# Altium schematic sheet 继电器驱动输出.SchDoc
size A2
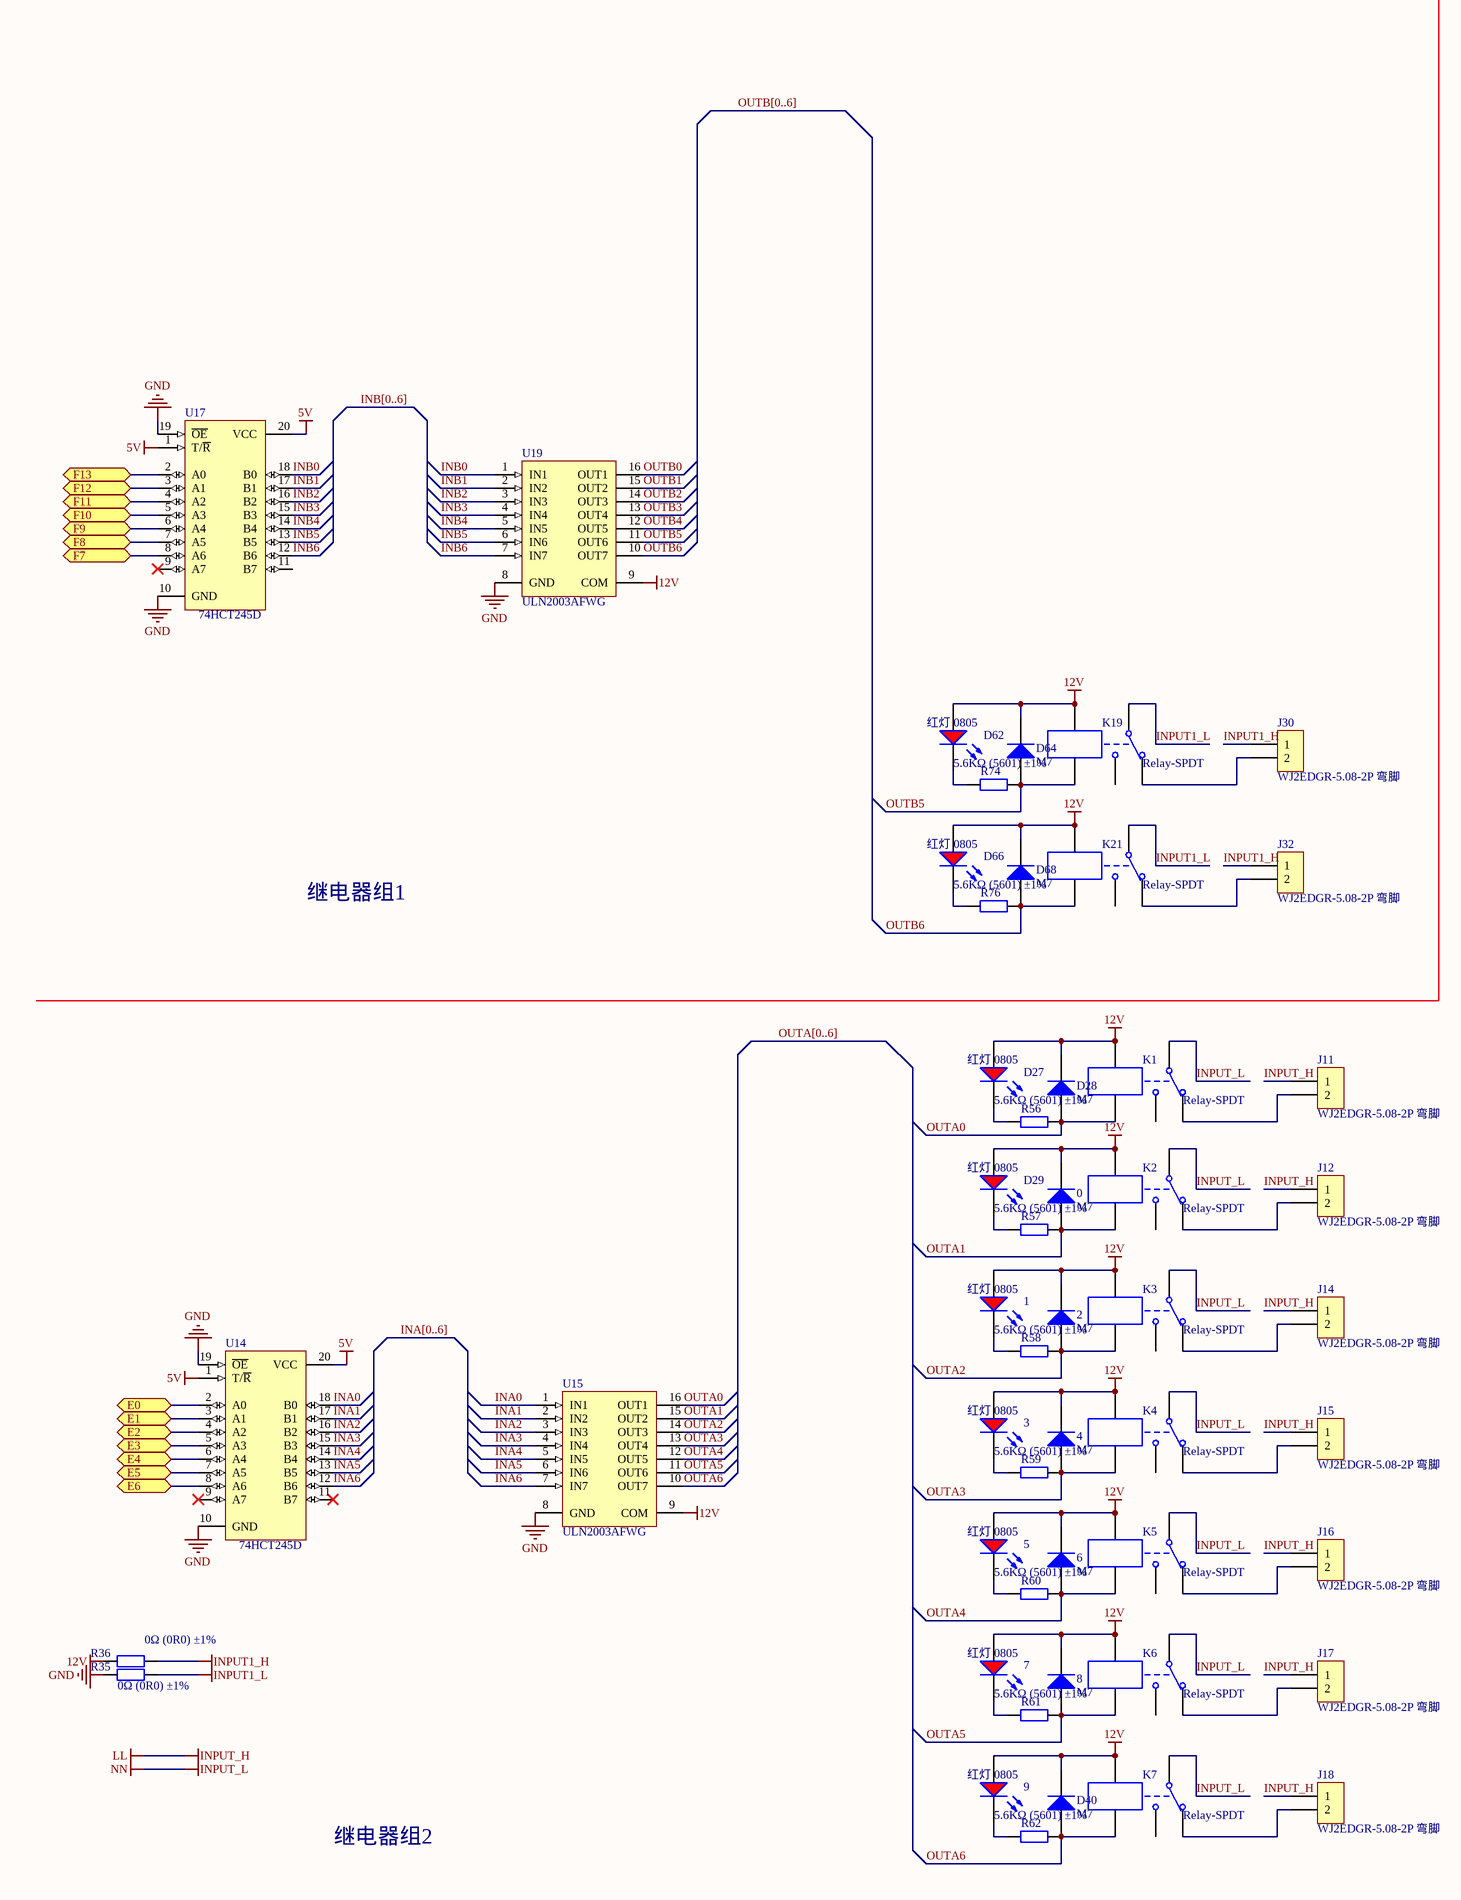
[diagram p0: 继电器驱动输出.SchDoc, left]
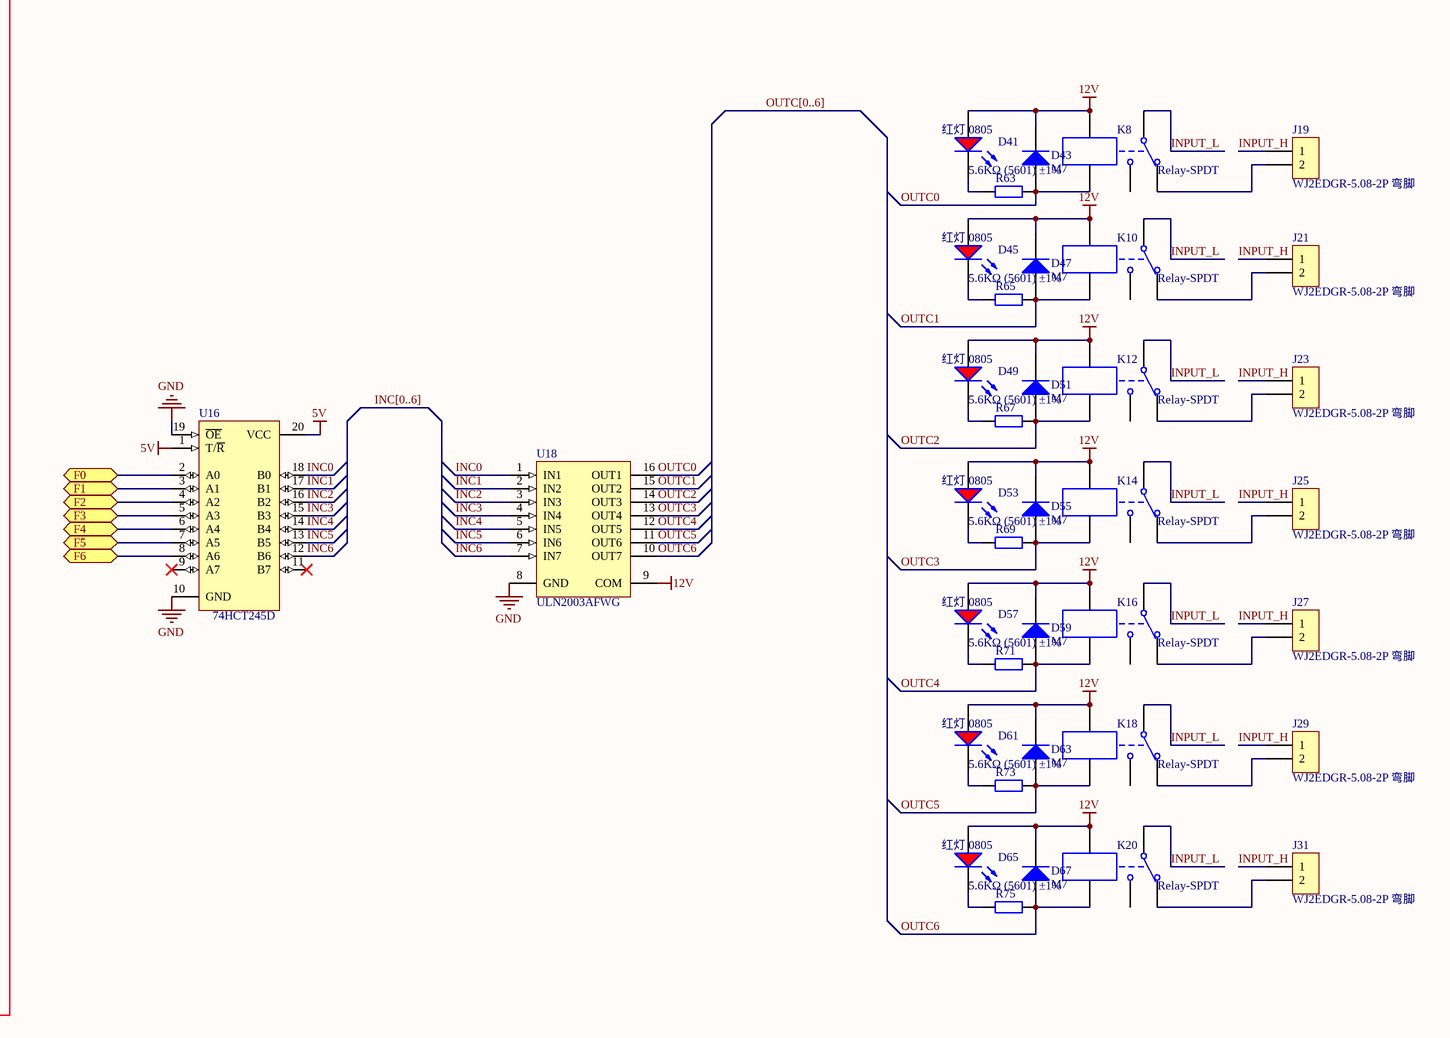
[diagram p1: 继电器驱动输出.SchDoc, right]

## Parts
0  M7  [SMA(DO-214AC)_S1]
1  红灯 0805  [0805_LED_S1]
2  M7  [SMA(DO-214AC)_S1]
3  红灯 0805  [0805_LED_S1]
4  M7  [SMA(DO-214AC)_S1]
5  红灯 0805  [0805_LED_S1]
6  M7  [SMA(DO-214AC)_S1]
7  红灯 0805  [0805_LED_S1]
8  M7  [SMA(DO-214AC)_S1]
9  红灯 0805  [0805_LED_S1]
D27  红灯 0805  [0805_LED_S1]
D28  M7  [SMA(DO-214AC)_S1]
D29  红灯 0805  [0805_LED_S1]
D40  M7  [SMA(DO-214AC)_S1]
D41  红灯 0805  [0805_LED_S1]
D43  M7  [SMA(DO-214AC)_S1]
D45  红灯 0805  [0805_LED_S1]
D47  M7  [SMA(DO-214AC)_S1]
D49  红灯 0805  [0805_LED_S1]
D51  M7  [SMA(DO-214AC)_S1]
D53  红灯 0805  [0805_LED_S1]
D55  M7  [SMA(DO-214AC)_S1]
D57  红灯 0805  [0805_LED_S1]
D59  M7  [SMA(DO-214AC)_S1]
D61  红灯 0805  [0805_LED_S1]
D62  红灯 0805  [0805_LED_S1]
D63  M7  [SMA(DO-214AC)_S1]
D64  M7  [SMA(DO-214AC)_S1]
D65  红灯 0805  [0805_LED_S1]
D66  红灯 0805  [0805_LED_S1]
D67  M7  [SMA(DO-214AC)_S1]
D68  M7  [SMA(DO-214AC)_S1]
J11  WJ2EDGR-5.08-2P 弯脚  [WJ2EDGR-5.08-2]
J12  WJ2EDGR-5.08-2P 弯脚  [WJ2EDGR-5.08-2]
J14  WJ2EDGR-5.08-2P 弯脚  [WJ2EDGR-5.08-2]
J15  WJ2EDGR-5.08-2P 弯脚  [WJ2EDGR-5.08-2]
J16  WJ2EDGR-5.08-2P 弯脚  [WJ2EDGR-5.08-2]
J17  WJ2EDGR-5.08-2P 弯脚  [WJ2EDGR-5.08-2]
J18  WJ2EDGR-5.08-2P 弯脚  [WJ2EDGR-5.08-2]
J19  WJ2EDGR-5.08-2P 弯脚  [WJ2EDGR-5.08-2]
J21  WJ2EDGR-5.08-2P 弯脚  [WJ2EDGR-5.08-2]
J23  WJ2EDGR-5.08-2P 弯脚  [WJ2EDGR-5.08-2]
J25  WJ2EDGR-5.08-2P 弯脚  [WJ2EDGR-5.08-2]
J27  WJ2EDGR-5.08-2P 弯脚  [WJ2EDGR-5.08-2]
J29  WJ2EDGR-5.08-2P 弯脚  [WJ2EDGR-5.08-2]
J30  WJ2EDGR-5.08-2P 弯脚  [WJ2EDGR-5.08-2]
J31  WJ2EDGR-5.08-2P 弯脚  [WJ2EDGR-5.08-2]
J32  WJ2EDGR-5.08-2P 弯脚  [WJ2EDGR-5.08-2]
K1  Relay-SPDT  [继电器5脚]
K2  Relay-SPDT  [继电器5脚]
K3  Relay-SPDT  [继电器5脚]
K4  Relay-SPDT  [继电器5脚]
K5  Relay-SPDT  [继电器5脚]
K6  Relay-SPDT  [继电器5脚]
K7  Relay-SPDT  [继电器5脚]
K8  Relay-SPDT  [继电器5脚]
K10  Relay-SPDT  [继电器5脚]
K12  Relay-SPDT  [继电器5脚]
K14  Relay-SPDT  [继电器5脚]
K16  Relay-SPDT  [继电器5脚]
K18  Relay-SPDT  [继电器5脚]
K19  Relay-SPDT  [继电器5脚]
K20  Relay-SPDT  [继电器5脚]
K21  Relay-SPDT  [继电器5脚]
R35  0Ω (0R0) ±1%  [1206_R]
R36  0Ω (0R0) ±1%  [1206_R]
R56  5.6KΩ (5601) ±1%  [0805_R]
R57  5.6KΩ (5601) ±1%  [0805_R]
R58  5.6KΩ (5601) ±1%  [0805_R]
R59  5.6KΩ (5601) ±1%  [0805_R]
R60  5.6KΩ (5601) ±1%  [0805_R]
R61  5.6KΩ (5601) ±1%  [0805_R]
R62  5.6KΩ (5601) ±1%  [0805_R]
R63  5.6KΩ (5601) ±1%  [0805_R]
R65  5.6KΩ (5601) ±1%  [0805_R]
R67  5.6KΩ (5601) ±1%  [0805_R]
R69  5.6KΩ (5601) ±1%  [0805_R]
R71  5.6KΩ (5601) ±1%  [0805_R]
R73  5.6KΩ (5601) ±1%  [0805_R]
R74  5.6KΩ (5601) ±1%  [0805_R]
R75  5.6KΩ (5601) ±1%  [0805_R]
R76  5.6KΩ (5601) ±1%  [0805_R]
U14  74HCT245D  [SOIC-20_300mil]
U15  ULN2003AFWG  [SOIC-16_150mil]
U16  74HCT245D  [SOIC-20_300mil]
U17  74HCT245D  [SOIC-20_300mil]
U18  ULN2003AFWG  [SOIC-16_150mil]
U19  ULN2003AFWG  [SOIC-16_150mil]

## Ports
E0, E1, E2, E3, E4, E5, E6, F0, F1, F2, F3, F4, F5, F6, F7, F8, F9, F10, F11, F12, F13

## Nets
5V: U14.1(T/~{R}) U14.20(VCC) U16.1(T/~{R}) U16.20(VCC) U17.1(T/~{R}) U17.20(VCC)
12V: 0.2(K) 1.A 2.2(K) 3.A 4.2(K) 5.A 6.2(K) 7.A 8.2(K) 9.A D27.A D28.2(K) D29.A D40.2(K) D41.A D43.2(K) D45.A D47.2(K) D49.A D51.2(K) D53.A D55.2(K) D57.A D59.2(K) D61.A D62.A D63.2(K) D64.2(K) D65.A D66.A D67.2(K) D68.2(K) K1.4 K2.4 K3.4 K4.4 K5.4 K6.4 K7.4 K8.4 K10.4 K12.4 K14.4 K16.4 K18.4 K19.4 K20.4 K21.4 R35.1 U15.9(COM) U18.9(COM) U19.9(COM)
GND: R36.1 U14.10(GND) U14.19(~{OE}) U15.8(GND) U16.10(GND) U16.19(~{OE}) U17.10(GND) U17.19(~{OE}) U18.8(GND) U19.8(GND)
INPUT1_H: J30.1 J32.1 R35.2
INPUT1_L: K19.1 K21.1 R36.2
INPUT_H: J11.1 J12.1 J14.1 J15.1 J16.1 J17.1 J18.1 J19.1 J21.1 J23.1 J25.1 J27.1 J29.1 J31.1  [also labelled LL]
INPUT_L: K1.1 K2.1 K3.1 K4.1 K5.1 K6.1 K7.1 K8.1 K10.1 K12.1 K14.1 K16.1 K18.1 K20.1  [also labelled NN]
E0: U14.2(A0) ; port E0
E1: U14.3(A1) ; port E1
E2: U14.4(A2) ; port E2
E3: U14.5(A3) ; port E3
E4: U14.6(A4) ; port E4
E5: U14.7(A5) ; port E5
E6: U14.8(A6) ; port E6
F0: U16.2(A0) ; port F0
F1: U16.3(A1) ; port F1
F2: U16.4(A2) ; port F2
F3: U16.5(A3) ; port F3
F4: U16.6(A4) ; port F4
F5: U16.7(A5) ; port F5
F6: U16.8(A6) ; port F6
F7: U17.8(A6) ; port F7
F8: U17.7(A5) ; port F8
F9: U17.6(A4) ; port F9
F10: U17.5(A3) ; port F10
F11: U17.4(A2) ; port F11
F12: U17.3(A1) ; port F12
F13: U17.2(A0) ; port F13
INA0: U14.18(B0) U15.1(IN1)
INA1: U14.17(B1) U15.2(IN2)
INA2: U14.16(B2) U15.3(IN3)
INA3: U14.15(B3) U15.4(IN4)
INA4: U14.14(B4) U15.5(IN5)
INA5: U14.13(B5) U15.6(IN6)
INA6: U14.12(B6) U15.7(IN7)
INB0: U17.18(B0) U19.1(IN1)
INB1: U17.17(B1) U19.2(IN2)
INB2: U17.16(B2) U19.3(IN3)
INB3: U17.15(B3) U19.4(IN4)
INB4: U17.14(B4) U19.5(IN5)
INB5: U17.13(B5) U19.6(IN6)
INB6: U17.12(B6) U19.7(IN7)
INC0: U16.18(B0) U18.1(IN1)
INC1: U16.17(B1) U18.2(IN2)
INC2: U16.16(B2) U18.3(IN3)
INC3: U16.15(B3) U18.4(IN4)
INC4: U16.14(B4) U18.5(IN5)
INC5: U16.13(B5) U18.6(IN6)
INC6: U16.12(B6) U18.7(IN7)
OUTA0: D28.1(A) K1.5 R56.2 U15.16(OUT1)
OUTA1: 0.1(A) K2.5 R57.2 U15.15(OUT2)
OUTA2: 2.1(A) K3.5 R58.2 U15.14(OUT3)
OUTA3: 4.1(A) K4.5 R59.2 U15.13(OUT4)
OUTA4: 6.1(A) K5.5 R60.2 U15.12(OUT5)
OUTA5: 8.1(A) K6.5 R61.2 U15.11(OUT6)
OUTA6: D40.1(A) K7.5 R62.2 U15.10(OUT7)
OUTB0: U19.16(OUT1)
OUTB1: U19.15(OUT2)
OUTB2: U19.14(OUT3)
OUTB3: U19.13(OUT4)
OUTB4: U19.12(OUT5)
OUTB5: D64.1(A) K19.5 R74.2 U19.11(OUT6)
OUTB6: D68.1(A) K21.5 R76.2 U19.10(OUT7)
OUTC0: D43.1(A) K8.5 R63.2 U18.16(OUT1)
OUTC1: D47.1(A) K10.5 R65.2 U18.15(OUT2)
OUTC2: D51.1(A) K12.5 R67.2 U18.14(OUT3)
OUTC3: D55.1(A) K14.5 R69.2 U18.13(OUT4)
OUTC4: D59.1(A) K16.5 R71.2 U18.12(OUT5)
OUTC5: D63.1(A) K18.5 R73.2 U18.11(OUT6)
OUTC6: D67.1(A) K20.5 R75.2 U18.10(OUT7)
Net1_K: 1.K R58.1
Net3_K: 3.K R59.1
Net5_K: 5.K R60.1
Net7_K: 7.K R61.1
Net9_K: 9.K R62.1
NetD27_K: D27.K R56.1
NetD29_K: D29.K R57.1
NetD41_K: D41.K R63.1
NetD45_K: D45.K R65.1
NetD49_K: D49.K R67.1
NetD53_K: D53.K R69.1
NetD57_K: D57.K R71.1
NetD61_K: D61.K R73.1
NetD62_K: D62.K R74.1
NetD65_K: D65.K R75.1
NetD66_K: D66.K R76.1
NetJ11_2: J11.2 K1.2
NetJ12_2: J12.2 K2.2
NetJ14_2: J14.2 K3.2
NetJ15_2: J15.2 K4.2
NetJ16_2: J16.2 K5.2
NetJ17_2: J17.2 K6.2
NetJ18_2: J18.2 K7.2
NetJ19_2: J19.2 K8.2
NetJ21_2: J21.2 K10.2
NetJ23_2: J23.2 K12.2
NetJ25_2: J25.2 K14.2
NetJ27_2: J27.2 K16.2
NetJ29_2: J29.2 K18.2
NetJ30_2: J30.2 K19.2
NetJ31_2: J31.2 K20.2
NetJ32_2: J32.2 K21.2

Not connected (* = marked no-connect by the designer): K1 3; K2 3; K3 3; K4 3; K5 3; K6 3; K7 3; K8 3; K10 3; K12 3; K14 3; K16 3; K18 3; K19 3; K20 3; K21 3; U14 9(A7)* 11(B7)*; U16 9(A7)* 11(B7)*; U17 9(A7)* 11(B7)

## Buses and harness runs
bus INA[0..6]
bus INB[0..6]
bus INC[0..6]
bus OUTA[0..6]
bus OUTB[0..6]
bus OUTC[0..6]

## Notes on the sheet
- 继电器组1
- 继电器组2

## Library data of the parts
0 2 4 6 8 D28 D40 D43 D47 D51 D55 D59 D63 D64 D67 D68 = SMA(DO-214AC) M7: 二极管; 备注: 1N4007 4007 编号C2464 已经停售, 使用新物料编号C95872; ComponentLink1Description: 供应商链接; ComponentLink1URL: http://www.szlcsc.com/product/details_2841.html; Package: SMA(DO-214AC); Supplier: LC; SuppliersPartNumber: C95872
1 3 5 7 9 D27 D29 D41 D45 D49 D53 D57 D61 D62 D65 D66 = 0805 红灯: 发光二极管; ComponentLink1Description: 供应商链接; ComponentLink1URL: http://www.szlcsc.com/product/details_2668.html; Package: 0805; Supplier: LC; SuppliersPartNumber: C2295
J11 J12 J14-J19 J21 J23 J25 J27 J29-J32 = WJ2EDGR-5.08-2P 弯脚: 2EDG连接器; ComponentLink1URL: https://detail.tmall.com/item.htm?spm=a1z10.5-b.w4011-14865958799.85.B0p41N&id=45355509244&rn=e90e7252b5175cd006380c5c01151190&abbucket=9; price: 0.28; Supplier: Farpu; SuppliersPartNumber: *; Manufacturer: *; ComponentLink1Description: 供应商链接
K1-K8 K10 K12 K14 K16 K18-K21 = Relay-SPDT: Single-Pole Dual-Throw Relay; Published: 24-Mar-1999; LatestRevisionDate: 17-Jul-2002; LatestRevisionNote: Re-released for DXP Platform.; PackageReference: MODULE5B; Publisher: Altium Limited
R35 R36 = 1206 0Ω (0R0) 1%: 贴片电阻; ComponentLink1Description: 供应商链接; ComponentLink1URL: http://www.szlcsc.com/product/details_18576.html; Package: 1206; Supplier: LC; SuppliersPartNumber: C17888
R56-R63 R65 R67 R69 R71 R73-R76 = 0805 5.6KΩ (5601) 1%: 贴片电阻; ComponentLink1Description: 供应商链接; ComponentLink1URL: http://www.szlcsc.com/product/details_4789.html; Package: 0805; Supplier: LC; SuppliersPartNumber: C4382
U14 U16 U17 = 74HC245D_[C5625]: 74系列逻辑芯片; ComponentLink1Description: 供应商链接; ComponentLink1URL: http://www.szlcsc.com/product/details_6076.html; Package: SOIC-20_300mil; Supplier: LC; SuppliersPartNumber: C5625
U15 U18 U19 = ULN2003AFWG_[C5437]: 大电流驱动; ComponentLink1Description: 供应商链接; ComponentLink1URL: http://www.szlcsc.com/product/details_5880.html; Package: SOIC-16_150mil; Supplier: LC; SuppliersPartNumber: C5437